# Altium project PCB_Project1.PrjPCB
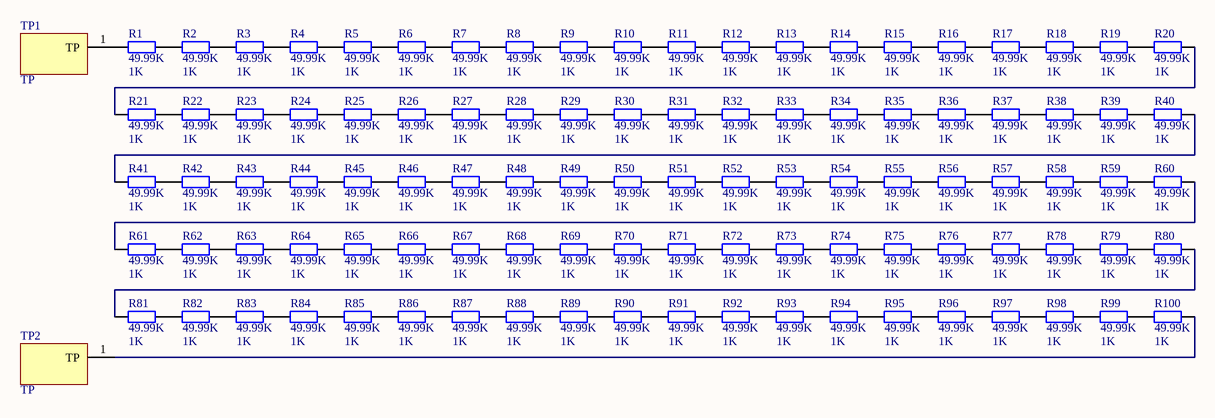
[diagram p0: Sheet1.SchDoc]
1 sheet, 102 parts. Net scope: global (net labels, ports and power ports of the same name join across sheets).
Board file: PCB1.PcbDoc

## Sheet Sheet1.SchDoc
size A4

### Parts
R1  49.99K  value 1K  [AXIAL-0.4]
R2  49.99K  value 1K  [AXIAL-0.4]
R3  49.99K  value 1K  [AXIAL-0.4]
R4  49.99K  value 1K  [AXIAL-0.4]
R5  49.99K  value 1K  [AXIAL-0.4]
R6  49.99K  value 1K  [AXIAL-0.4]
R7  49.99K  value 1K  [AXIAL-0.4]
R8  49.99K  value 1K  [AXIAL-0.4]
R9  49.99K  value 1K  [AXIAL-0.4]
R10  49.99K  value 1K  [AXIAL-0.4]
R11  49.99K  value 1K  [AXIAL-0.4]
R12  49.99K  value 1K  [AXIAL-0.4]
R13  49.99K  value 1K  [AXIAL-0.4]
R14  49.99K  value 1K  [AXIAL-0.4]
R15  49.99K  value 1K  [AXIAL-0.4]
R16  49.99K  value 1K  [AXIAL-0.4]
R17  49.99K  value 1K  [AXIAL-0.4]
R18  49.99K  value 1K  [AXIAL-0.4]
R19  49.99K  value 1K  [AXIAL-0.4]
R20  49.99K  value 1K  [AXIAL-0.4]
R21  49.99K  value 1K  [AXIAL-0.4]
R22  49.99K  value 1K  [AXIAL-0.4]
R23  49.99K  value 1K  [AXIAL-0.4]
R24  49.99K  value 1K  [AXIAL-0.4]
R25  49.99K  value 1K  [AXIAL-0.4]
R26  49.99K  value 1K  [AXIAL-0.4]
R27  49.99K  value 1K  [AXIAL-0.4]
R28  49.99K  value 1K  [AXIAL-0.4]
R29  49.99K  value 1K  [AXIAL-0.4]
R30  49.99K  value 1K  [AXIAL-0.4]
R31  49.99K  value 1K  [AXIAL-0.4]
R32  49.99K  value 1K  [AXIAL-0.4]
R33  49.99K  value 1K  [AXIAL-0.4]
R34  49.99K  value 1K  [AXIAL-0.4]
R35  49.99K  value 1K  [AXIAL-0.4]
R36  49.99K  value 1K  [AXIAL-0.4]
R37  49.99K  value 1K  [AXIAL-0.4]
R38  49.99K  value 1K  [AXIAL-0.4]
R39  49.99K  value 1K  [AXIAL-0.4]
R40  49.99K  value 1K  [AXIAL-0.4]
R41  49.99K  value 1K  [AXIAL-0.4]
R42  49.99K  value 1K  [AXIAL-0.4]
R43  49.99K  value 1K  [AXIAL-0.4]
R44  49.99K  value 1K  [AXIAL-0.4]
R45  49.99K  value 1K  [AXIAL-0.4]
R46  49.99K  value 1K  [AXIAL-0.4]
R47  49.99K  value 1K  [AXIAL-0.4]
R48  49.99K  value 1K  [AXIAL-0.4]
R49  49.99K  value 1K  [AXIAL-0.4]
R50  49.99K  value 1K  [AXIAL-0.4]
R51  49.99K  value 1K  [AXIAL-0.4]
R52  49.99K  value 1K  [AXIAL-0.4]
R53  49.99K  value 1K  [AXIAL-0.4]
R54  49.99K  value 1K  [AXIAL-0.4]
R55  49.99K  value 1K  [AXIAL-0.4]
R56  49.99K  value 1K  [AXIAL-0.4]
R57  49.99K  value 1K  [AXIAL-0.4]
R58  49.99K  value 1K  [AXIAL-0.4]
R59  49.99K  value 1K  [AXIAL-0.4]
R60  49.99K  value 1K  [AXIAL-0.4]
R61  49.99K  value 1K  [AXIAL-0.4]
R62  49.99K  value 1K  [AXIAL-0.4]
R63  49.99K  value 1K  [AXIAL-0.4]
R64  49.99K  value 1K  [AXIAL-0.4]
R65  49.99K  value 1K  [AXIAL-0.4]
R66  49.99K  value 1K  [AXIAL-0.4]
R67  49.99K  value 1K  [AXIAL-0.4]
R68  49.99K  value 1K  [AXIAL-0.4]
R69  49.99K  value 1K  [AXIAL-0.4]
R70  49.99K  value 1K  [AXIAL-0.4]
R71  49.99K  value 1K  [AXIAL-0.4]
R72  49.99K  value 1K  [AXIAL-0.4]
R73  49.99K  value 1K  [AXIAL-0.4]
R74  49.99K  value 1K  [AXIAL-0.4]
R75  49.99K  value 1K  [AXIAL-0.4]
R76  49.99K  value 1K  [AXIAL-0.4]
R77  49.99K  value 1K  [AXIAL-0.4]
R78  49.99K  value 1K  [AXIAL-0.4]
R79  49.99K  value 1K  [AXIAL-0.4]
R80  49.99K  value 1K  [AXIAL-0.4]
R81  49.99K  value 1K  [AXIAL-0.4]
R82  49.99K  value 1K  [AXIAL-0.4]
R83  49.99K  value 1K  [AXIAL-0.4]
R84  49.99K  value 1K  [AXIAL-0.4]
R85  49.99K  value 1K  [AXIAL-0.4]
R86  49.99K  value 1K  [AXIAL-0.4]
R87  49.99K  value 1K  [AXIAL-0.4]
R88  49.99K  value 1K  [AXIAL-0.4]
R89  49.99K  value 1K  [AXIAL-0.4]
R90  49.99K  value 1K  [AXIAL-0.4]
R91  49.99K  value 1K  [AXIAL-0.4]
R92  49.99K  value 1K  [AXIAL-0.4]
R93  49.99K  value 1K  [AXIAL-0.4]
R94  49.99K  value 1K  [AXIAL-0.4]
R95  49.99K  value 1K  [AXIAL-0.4]
R96  49.99K  value 1K  [AXIAL-0.4]
R97  49.99K  value 1K  [AXIAL-0.4]
R98  49.99K  value 1K  [AXIAL-0.4]
R99  49.99K  value 1K  [AXIAL-0.4]
R100  49.99K  value 1K  [AXIAL-0.4]
TP1  TP  [TP]
TP2  TP  [TP]

### Nets
NetR1_1: R1.1 R2.2
NetR1_2: R1.2 TP1.1(TP)
NetR2_1: R2.1 R3.2
NetR3_1: R3.1 R4.2
NetR4_1: R4.1 R5.2
NetR5_1: R5.1 R6.2
NetR6_1: R6.1 R7.2
NetR7_1: R7.1 R8.2
NetR8_1: R8.1 R9.2
NetR9_1: R9.1 R10.2
NetR10_1: R10.1 R11.2
NetR11_1: R11.1 R12.2
NetR12_1: R12.1 R13.2
NetR13_1: R13.1 R14.2
NetR14_1: R14.1 R15.2
NetR15_1: R15.1 R16.2
NetR16_1: R16.1 R17.2
NetR17_1: R17.1 R18.2
NetR18_1: R18.1 R19.2
NetR19_1: R19.1 R20.2
NetR20_1: R20.1 R21.2
NetR21_1: R21.1 R22.2
NetR22_1: R22.1 R23.2
NetR23_1: R23.1 R24.2
NetR24_1: R24.1 R25.2
NetR25_1: R25.1 R26.2
NetR26_1: R26.1 R27.2
NetR27_1: R27.1 R28.2
NetR28_1: R28.1 R29.2
NetR29_1: R29.1 R30.2
NetR30_1: R30.1 R31.2
NetR31_1: R31.1 R32.2
NetR32_1: R32.1 R33.2
NetR33_1: R33.1 R34.2
NetR34_1: R34.1 R35.2
NetR35_1: R35.1 R36.2
NetR36_1: R36.1 R37.2
NetR37_1: R37.1 R38.2
NetR38_1: R38.1 R39.2
NetR39_1: R39.1 R40.2
NetR40_1: R40.1 R41.2
NetR41_1: R41.1 R42.2
NetR42_1: R42.1 R43.2
NetR43_1: R43.1 R44.2
NetR44_1: R44.1 R45.2
NetR45_1: R45.1 R46.2
NetR46_1: R46.1 R47.2
NetR47_1: R47.1 R48.2
NetR48_1: R48.1 R49.2
NetR49_1: R49.1 R50.2
NetR50_1: R50.1 R51.2
NetR51_1: R51.1 R52.2
NetR52_1: R52.1 R53.2
NetR53_1: R53.1 R54.2
NetR54_1: R54.1 R55.2
NetR55_1: R55.1 R56.2
NetR56_1: R56.1 R57.2
NetR57_1: R57.1 R58.2
NetR58_1: R58.1 R59.2
NetR59_1: R59.1 R60.2
NetR60_1: R60.1 R61.2
NetR61_1: R61.1 R62.2
NetR62_1: R62.1 R63.2
NetR63_1: R63.1 R64.2
NetR64_1: R64.1 R65.2
NetR65_1: R65.1 R66.2
NetR66_1: R66.1 R67.2
NetR67_1: R67.1 R68.2
NetR68_1: R68.1 R69.2
NetR69_1: R69.1 R70.2
NetR70_1: R70.1 R71.2
NetR71_1: R71.1 R72.2
NetR72_1: R72.1 R73.2
NetR73_1: R73.1 R74.2
NetR74_1: R74.1 R75.2
NetR75_1: R75.1 R76.2
NetR76_1: R76.1 R77.2
NetR77_1: R77.1 R78.2
NetR78_1: R78.1 R79.2
NetR79_1: R79.1 R80.2
NetR80_1: R80.1 R81.2
NetR81_1: R81.1 R82.2
NetR82_1: R82.1 R83.2
NetR83_1: R83.1 R84.2
NetR84_1: R84.1 R85.2
NetR85_1: R85.1 R86.2
NetR86_1: R86.1 R87.2
NetR87_1: R87.1 R88.2
NetR88_1: R88.1 R89.2
NetR89_1: R89.1 R90.2
NetR90_1: R90.1 R91.2
NetR91_1: R91.1 R92.2
NetR92_1: R92.1 R93.2
NetR93_1: R93.1 R94.2
NetR94_1: R94.1 R95.2
NetR95_1: R95.1 R96.2
NetR96_1: R96.1 R97.2
NetR97_1: R97.1 R98.2
NetR98_1: R98.1 R99.2
NetR99_1: R99.1 R100.2
NetR100_1: R100.1 TP2.1(TP)

### Library data of the parts
R1-R100 = Res2: Resistor; Published: 8-Jun-2000; LatestRevisionDate: 17-Jul-2002; LatestRevisionNote: Re-released for DXP Platform.; PackageReference: AXIAL-0.4; Publisher: Altium Limited